# Altium schematic sheet BidirectionalSwitch.SchDoc
size A; SheetNumber: 1; SheetTotal: 1
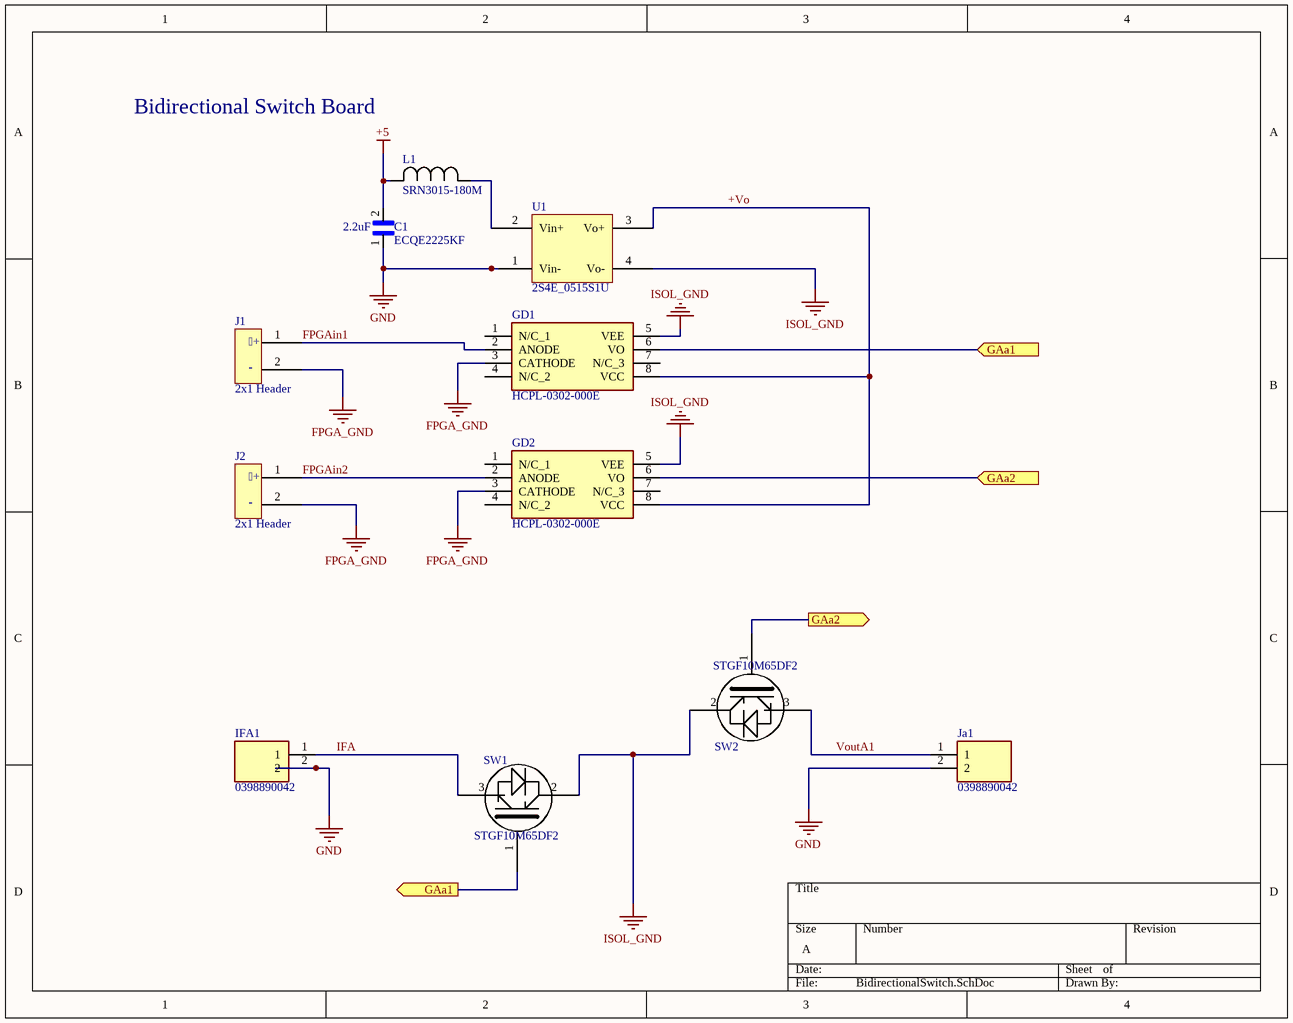
[diagram p0: BidirectionalSwitch.SchDoc]

## Parts
C1  ECQE2225KF  value 2.2uF  [CAPRR2250W80L2600T850H1630]
GD1  HCPL-0302-000E  [SOT127P599X361-8N]
GD2  HCPL-0302-000E  [SOT127P599X361-8N]
IFA1  0398890042  [0398890042]
J1  1  (value not drawn)
J2  1  (value not drawn)
Ja1  0398890042  [0398890042]
L1  SRN3015-180M  [IND_BOURNS_SRN3015]
SW1  STGF10M65DF2  [TO-220FP_STM]
SW2  STGF10M65DF2  [TO-220FP_STM]
U1  2S4E_0515S1U  [2S4E_0515S1U]

## Ports
GAa1 (in, see BidirectionalSwitch[2D]), GAa1 (out, see BidirectionalSwitch[4B]), GAa2 (in, see BidirectionalSwitch[3C]), GAa2 (out, see BidirectionalSwitch[4B])

## Nets
+5: C1.2 L1.2
FPGA_GND: GD1.3(CATHODE) GD2.3(CATHODE) J1.2 J2.2
GND: C1.1 IFA1.2 Ja1.2 U1.1(Vin-)
ISOL_GND: GD1.5(VEE) GD2.5(VEE) SW1.2(C) SW2.2(C) U1.4(Vo-)
+Vo: GD1.8(VCC) GD2.8(VCC) U1.3(Vo+)
FPGAin1: GD1.2(ANODE) J1.1
FPGAin2: GD2.2(ANODE) J2.1
GAa1: GD1.6(VO) SW1.1(G) ; port GAa1
GAa2: GD2.6(VO) SW2.1(G) ; port GAa2
IFA: IFA1.1 SW1.3(E)
VoutA1: Ja1.1 SW2.3(E)
NetL1_1: L1.1 U1.2(Vin+)

Not connected (* = marked no-connect by the designer): GD1 1(N/C_1) 4(N/C_2) 7(N/C_3); GD2 1(N/C_1) 4(N/C_2) 7(N/C_3)

## Notes on the sheet
- Bidirectional Switch Board
- (in symbol Header 2x1) +; -; 2x1 Header

## Library data of the parts
GD1 GD2 = HCPL-0302-000E: Integrated Circuit; Manufacturer_Name: Avago Technologies; Datasheet Link: https://componentsearchengine.com/Datasheets/2/HCPL-0302-000E.pdf; Height: 3.607mm; Manufacturer_Part_Number: HCPL-0302-000E; Mouser Part Number: 630-HCPL-0302-000E; Mouser Price/Stock: https://www.mouser.co.uk/ProductDetail/Broadcom-Avago/HCPL-0302-000E?qs=xnajaXqBF98nZXSlVjkZuQ%3D%3D
IFA1 Ja1 = 0398890042: Conn Eurostyle Block 2 POS 5.08mm Solder ST Thru-Hole 17.5A/Contact; Manufacturer_Name: Molex; Geometry.Height: 10.25mm; TTI Part Number: *; TTI Price/Stock: *; Manufacturer_Part_Number: 0398890042; Datasheet Link: https://tools.molex.com/pdm_docs/sd/398890042_sd.pdf
J1 J2 = Header 2x1
L1 = SRN3015-180M: No Description Available; Mfr_Name: Bourns Electronics
SW1 SW2 = STGF10M65DF2: No Description Available; Mfr_Name: STMicroelectronics; RefDes: RefDes; Type: Type
U1 = 2S4E_0515S1U: 2S4E_0515S1U DC-DC Converter; ComponentLink1Description: New link; ComponentLink1URL: https://gaptec-electronic.com/datenblaetter/2S4E_1U.pdf
C1 = ECQE2225KF: Price: None; Availability: Unavailable; MP: ECQE2225KF; Package: None